# EAGLE design main_board3 (EAGLE 6.1)
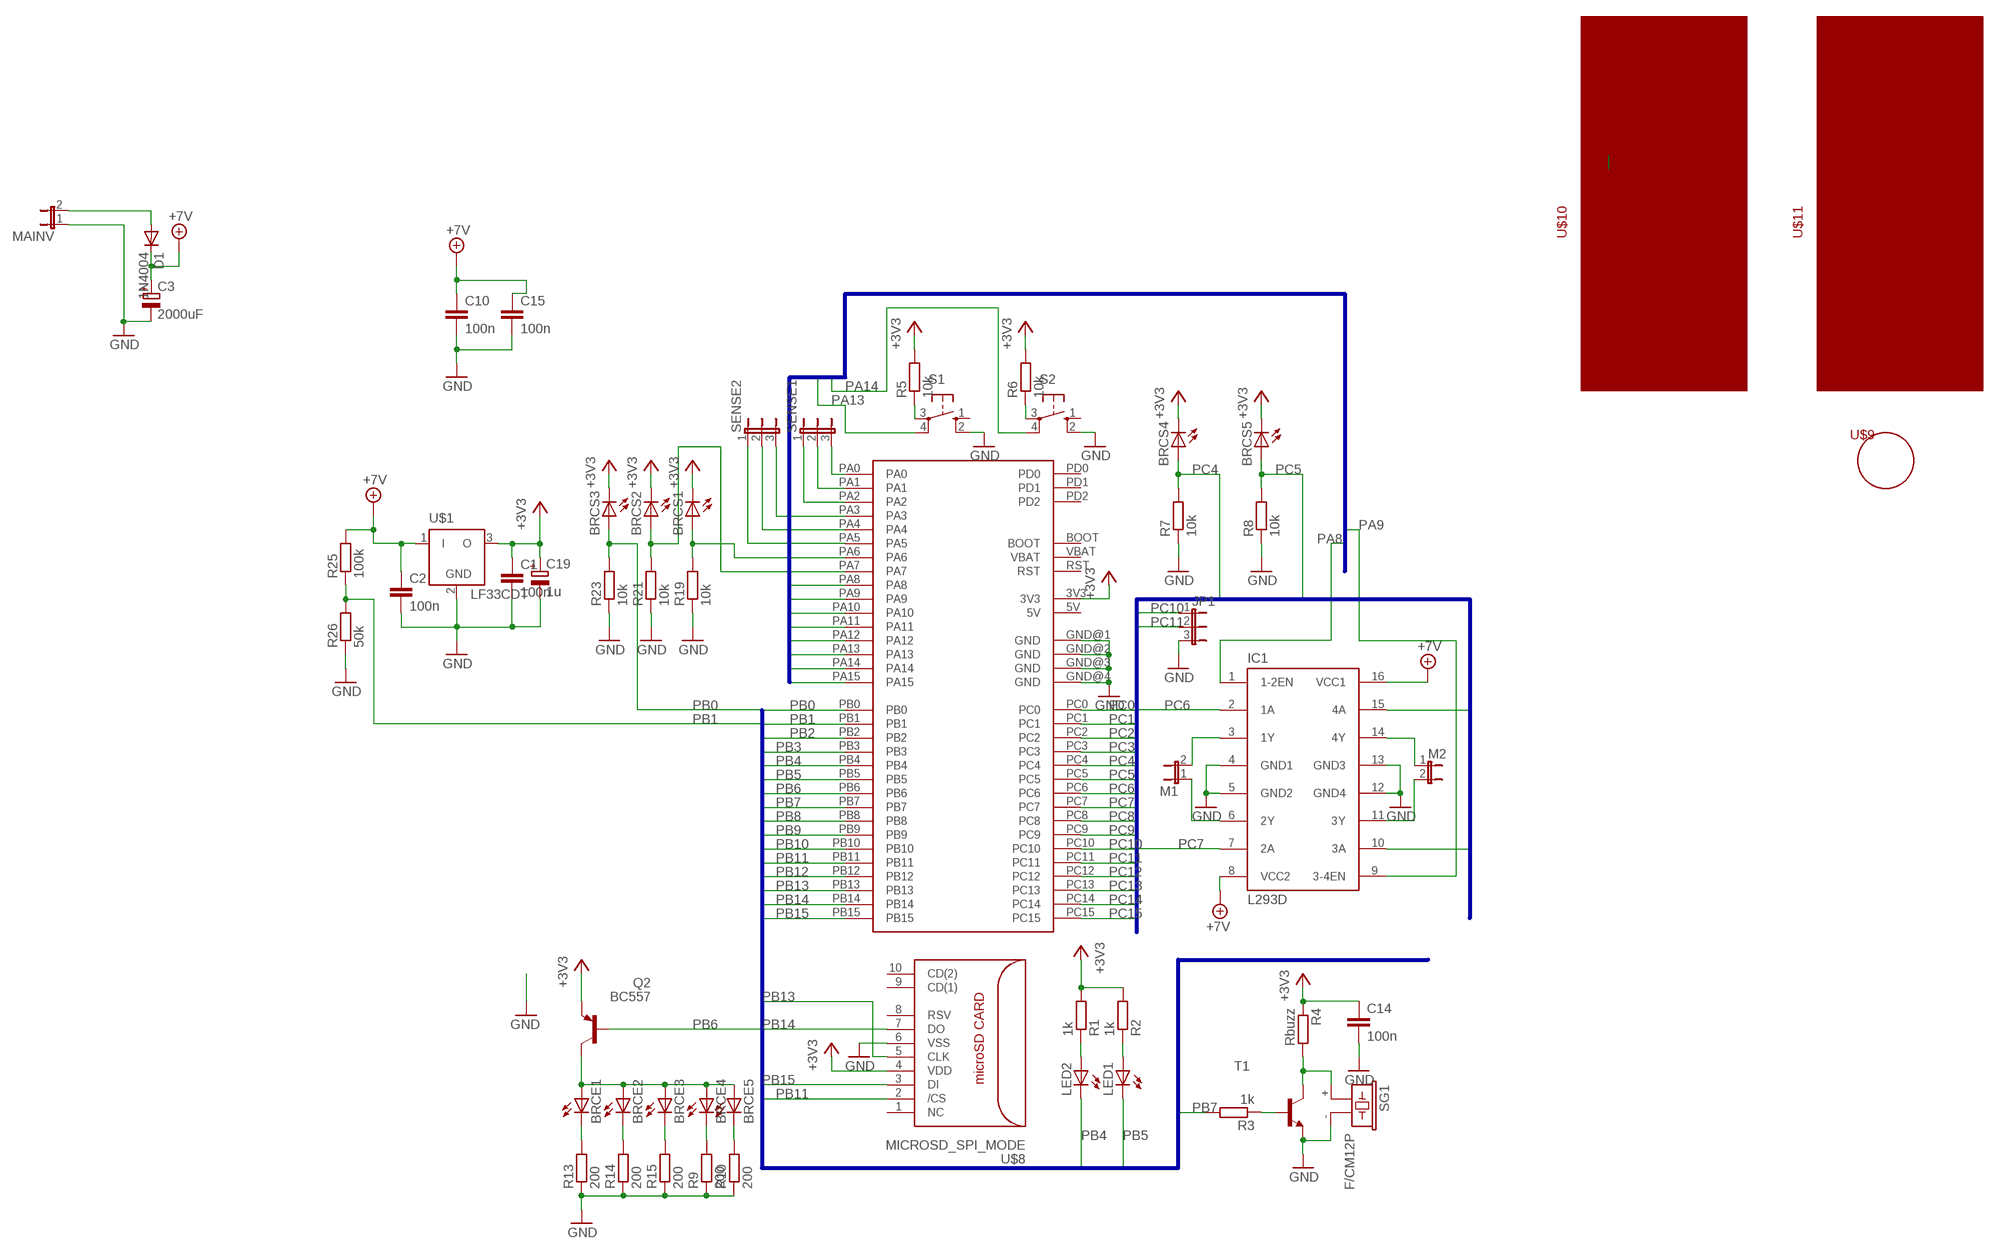
[diagram p0: schematic, sheet 1]

## Parts
BRCE1  LED5MM  [LED5MM]
BRCE2  LED5MM  [LED5MM]
BRCE3  LED5MM  [LED5MM]
BRCE4  LED5MM  [LED5MM]
BRCE5  LED5MM  [LED5MM]
BRCS1  LED5MM  [LED5MM]
BRCS2  LED5MM  [LED5MM]
BRCS3  LED5MM  [LED5MM]
BRCS4  LED5MM  [LED5MM]
BRCS5  LED5MM  [LED5MM]
C1  100n  C-EUC1206  [C1206]
C2  100n  C-EUC1206  [C1206]
C3  2000uF  CPOL-EUE3.5-10  [E3,5-10]
C10  100n  C-EUC1206  [C1206]
C14  100n  C-EUC1206  [C1206]
C15  100n  C-EUC1206  [C1206]
C19  1u  CPOL-EUB  [PANASONIC_B]
D1  1N4004  [DO41-10]
IC1  L293D  [DIL16]
JP1  JP2E  [JP2]
LED1  LED3MM  [LED3MM]
LED2  LED3MM  [LED3MM]
M1  JP1E  [JP1]
M2  JP1E  [JP1]
MAINV  JP1E  [JP1]
Q2  BC557  [TO92]
R1  1k  R-EU_M1206  [M1206]
R2  1k  R-EU_M1206  [M1206]
R3  1k  R-EU_M1206  [M1206]
R4  Rbuzz  R-EU_M1206  [M1206]
R5  10k  R-EU_M1206  [M1206]
R6  10k  R-EU_M1206  [M1206]
R7  10k  R-EU_M1206  [M1206]
R8  10k  R-EU_M1206  [M1206]
R9  200  R-EU_M1206  [M1206]
R10  200  R-EU_M1206  [M1206]
R13  200  R-EU_M1206  [M1206]
R14  200  R-EU_M1206  [M1206]
R15  200  R-EU_M1206  [M1206]
R19  10k  R-EU_M1206  [M1206]
R21  10k  R-EU_M1206  [M1206]
R23  10k  R-EU_M1206  [M1206]
R25  100k  R-EU_M1206  [M1206]
R26  50k  R-EU_M1206  [M1206]
S1  10-XX  [B3F-10XX]
S2  10-XX  [B3F-10XX]
SENSE1  JP2E  [JP2]
SENSE2  JP2E  [JP2]
SG1  F/CM12P  [F/CM12P]
T1  BC547B-NPN-TO92-CBE  [TO92-CBE]
U$1  LF33CDT  [DPAK]
U$2  STM32_DISCOVERY  [STM32_DISCOVERY]
U$8  MICROSD_SPI_MODE  [MICRO_SD_CONNECTOR]
U$9  POLOLU952  [BALLB]
U$10  POLOLU0993B  [MOTORB]
U$11  POLOLU0993B  [MOTORB]

## Nets
+3V3: BRCS1.K(C) BRCS2.K(C) BRCS3.K(C) BRCS4.K(C) BRCS5.K(C) C1.1 C14.1 C19.+ Q2.1(E) R1.2 R2.2 R4.1 R5.2 R6.2 U$1.3(O) U$2.3V3 U$8.4(VDD)
+7V: C2.1 C3.+ C10.1 C15.1 D1.C IC1.8(VCC2) IC1.16(VCC1) R25.2 U$1.1(I)
GND: C1.2 C2.2 C3.- C10.2 C14.2 C15.2 C19.- IC1.4(GND1) IC1.5(GND2) IC1.12(GND4) IC1.13(GND3) JP1.3 MAINV.1 R7.1 R8.1 R9.1 R10.1 R13.1 R14.1 R15.1 R19.1 R21.1 R23.1 R26.1 S1.2(S1) S2.2(S1) SG1.- T1.E U$1.2(GND) U$2.GND@1(GND) U$2.GND@2(GND) U$2.GND@3(GND) U$2.GND@4(GND) U$8.6(VSS)
N$1: SENSE1.3 U$2.PA0
N$2: SENSE1.2 U$2.PA1
N$3: SENSE1.1 U$2.PA2
N$4: SENSE2.3 U$2.PA3
N$5: SENSE2.2 U$2.PA4
N$6: SENSE2.1 U$2.PA5
N$7: LED2.A R1.1
N$8: LED1.A R2.1
N$9: R3.1 T1.B
N$10: R4.2 SG1.+ T1.C
N$11: R6.1 S2.3(P)
N$12: R5.1 S1.3(P)
N$13: BRCE4.K(C) R9.2
N$14: BRCE5.K(C) R10.2
N$28: BRCE1.K(C) R13.2
N$29: BRCE2.K(C) R14.2
N$30: BRCE3.K(C) R15.2
N$31: BRCE1.A BRCE2.A BRCE3.A BRCE4.A BRCE5.A Q2.3(C)
N$43: D1.A MAINV.2
N$44: BRCS1.A R19.2 U$2.PA6
N$46: BRCS2.A R21.2 U$2.PA7
N$53: IC1.3(1Y) M1.2
N$54: IC1.6(2Y) M1.1
N$55: IC1.14(4Y) M2.1
N$56: IC1.11(3Y) M2.2
PA8: IC1.1(1-2EN) U$2.PA8
PA9: IC1.9(3-4EN) U$2.PA9
PA10: U$2.PA10
PA11: U$2.PA11
PA12: U$2.PA12
PA13: S1.4(P1) U$2.PA13
PA14: S2.4(P1) U$2.PA14
PA15: U$2.PA15
PB0: BRCS3.A R23.2 U$2.PB0
PB1: R25.1 R26.2 U$2.PB1
PB2: U$2.PB2
PB3: U$2.PB3
PB4: LED2.K(C) U$2.PB4
PB5: LED1.K(C) U$2.PB5
PB6: Q2.2(B) U$2.PB6
PB7: R3.2 U$2.PB7
PB8: U$2.PB8
PB9: U$2.PB9
PB10: U$2.PB10
PB11: U$2.PB11 U$8.2(/CS)
PB12: U$2.PB12
PB13: U$2.PB13 U$8.5(CLK)
PB14: U$2.PB14 U$8.7(DO)
PB15: U$2.PB15 U$8.3(DI)
PC0: U$2.PC0
PC1: U$2.PC1
PC2: U$2.PC2
PC3: U$2.PC3
PC4: BRCS4.A R7.2 U$2.PC4
PC5: BRCS5.A R8.2 U$2.PC5
PC6: IC1.2(1A) U$2.PC6
PC7: IC1.7(2A) U$2.PC7
PC8: IC1.15(4A) U$2.PC8
PC9: IC1.10(3A) U$2.PC9
PC10: JP1.1 U$2.PC10
PC11: JP1.2 U$2.PC11
PC12: U$2.PC12
PC13: U$2.PC13
PC14: U$2.PC14
PC15: U$2.PC15
Unconnected: S1.1(S) S2.1(S) U$2.5V U$2.BOOT U$2.NC@1(NC) U$2.NC@2(NC) U$2.PD0 U$2.PD1 U$2.PD2 U$2.RST U$2.VBAT U$8.1(NC) U$8.8(RSV) U$8.9(CD(1)) U$8.10(CD(2))

## Buses
PC[0..15]
PB[0..15]
PA[8..15]

## Library data of the parts
BRCE1-BRCE5 BRCS1-BRCS5 LED1 LED2 = led:LED: LED OSRAM: - CHIPLED LG R971, LG N971, LY N971, LG Q971, LY Q971, LO R971, LY R971 LH N974, LH R974 LS Q976, LO Q976, LY Q976 LO Q996 - Hyper CHIPLED LW Q18S LB Q993, LB Q99A, LB R99A - SideLED LS A670, LO A670, LY A670, LG A670, LP A670 LB A673, LV A673, LT A673, LW A673 LH A674 LY A675 LS A676, LA A676, LO A676, LY A676, LW A676 LS A679, LY A679, LG A679 - Hyper Micro SIDELED® LS Y876, LA Y876, LO Y876, LY Y876 LT Y87S - SmartLED LW L88C, LW L88S LB L89C, LB L89S, LG L890 LS L89K, LO L89K, LY L89K LS L896, LA L896, LO L896, LY L896 - TOPLED LS T670, LO T670, LY T670, LG T670, LP T670 LSG T670, LSP T670, LSY T670, LOP T670, LYG T670 LG T671, LOG T671, LSG T671 LB T673, LV T673, LT T673, LW T673 LH T674 LS T676, LA T676, LO T676, LY T676, LB T676, LH T676, LSB T676, LW T676 LB T67C, LV T67C, LT T67C, LS T67K, LO T67K, LY T67K, LW E67C LS E67B, LA E67B, LO E67B, LY E67B, LB E67C, LV E67C, LT E67C LW T67C LS T679, LY T679, LG T679 LS T770, LO T770, LY T770, LG T770, LP T770 LB T773, LV T773, LT T773, LW T773 LH T774 LS E675, LA E675, LY E675, LS T675 LS T776, LA T776, LO T776, LY T776, LB T776 LHGB T686 LT T68C, LB T68C - Hyper Mini TOPLED® LB M676 - Mini TOPLED Santana® LG M470 LS M47K, LO M47K, LY M47K Source: http://www.osram.convergy.de LUXEON: - LUMILED® LXK2-PW12-R00, LXK2-PW12-S00, LXK2-PW14-U00, LXK2-PW14-V00 LXK2-PM12-R00, LXK2-PM12-S00, LXK2-PM14-U00 LXK2-PE12-Q00, LXK2-PE12-R00, LXK2-PE12-S00, LXK2-PE14-T00, LXK2-PE14-U00 LXK2-PB12-K00, LXK2-PB12-L00, LXK2-PB12-M00, LXK2-PB14-N00, LXK2-PB14-P00, LXK2-PB14-Q00 LXK2-PR12-L00, LXK2-PR12-M00, LXK2-PR14-Q00, LXK2-PR14-R00 LXK2-PD12-Q00, LXK2-PD12-R00, LXK2-PD12-S00 LXK2-PH12-R00, LXK2-PH12-S00 LXK2-PL12-P00, LXK2-PL12-Q00, LXK2-PL12-R00 Source: www.luxeon.com KINGBRIGHT: KA-3528ASYC Source: www.kingbright.com
C1 C2 C10 C14 C15 = rcl:C-EU: CAPACITOR, European symbol
C3 C19 = rcl:CPOL-EU: POLARIZED CAPACITOR, European symbol
D1 = diode:1N4004: DIODE general purpose rectifier, 1 A
IC1 = st-microelectronics:L293D: PUSH-PULL 4 CHANNEL DRIVER; MPN: L293D; OC_FARNELL: 9589619; OC_NEWARK: 56P8249
JP1 SENSE1 SENSE2 = jumper:JP2E: JUMPER
M1 M2 MAINV = jumper:JP1E: JUMPER
Q2 = transistor-pnp:BC557: PNP Transistor
R1-R10 R13-R15 R19 R21 R23 R25 R26 = resistor:R-EU_: RESISTOR, European symbol
S1 S2 = switch-omron:10-XX: OMRON SWITCH; MPN: B3F-1000; OC_FARNELL: 176432; OC_NEWARK: 36M3542
SG1 = buzzer:F/CM12P: BUZZER Source: Buerklin; OC_FARNELL: unknown; OC_NEWARK: unknown
T1 = transistor:*-NPN-: NPN Transistror BF959 corrected 2008.03.06
U$1 = robot:LF33CDT
U$2 = stm32_discovery:STM32_DISCOVERY: STM32 Value line discovery
U$8 = con-molex-microsd:MICROSD_SPI_MODE: MOLEX - 49225-0821 - CONNECTEUR MICRO SD PUSH/PUSH REV Fabricant: MOLEX Code commande Farnell: 1366700 <http://fr.farnell.com/molex/49225-0821/connecteur-micro-sd-push-push-rev/dp/1366700?Ntt=1366700> Référence fabricant: 49225-0821
U$9 = robot:POLOLU952
U$10 U$11 = robot:POLOLU0993B

## Board
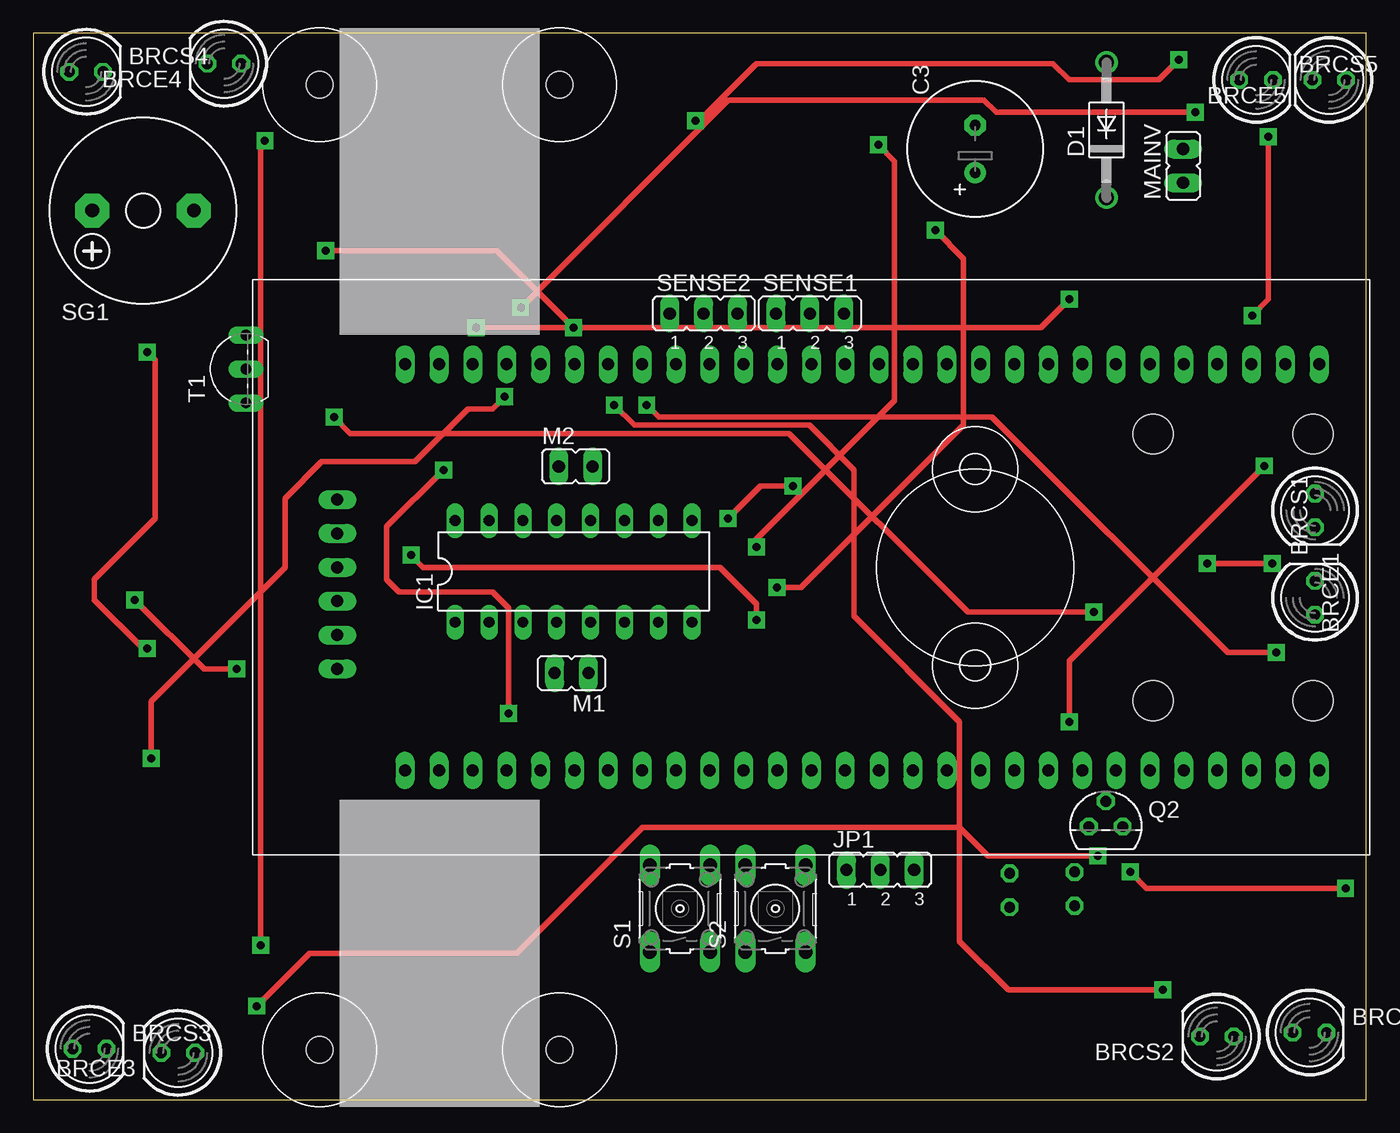
[diagram p1: board, top side]
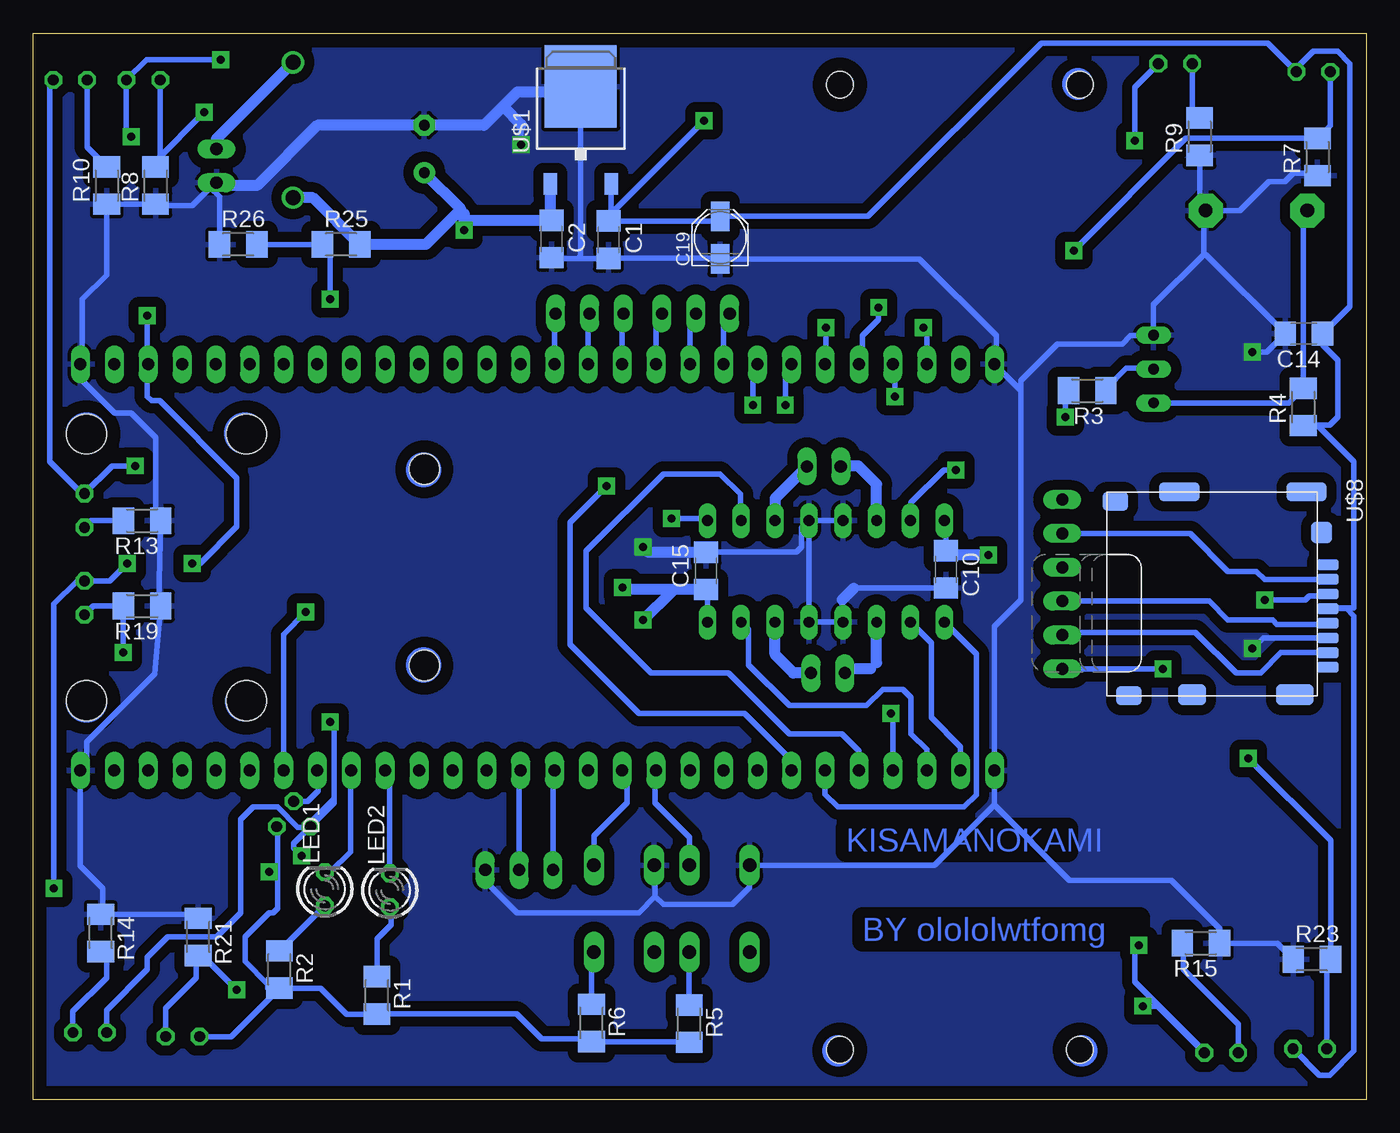
[diagram p2: board, bottom side, seen from below]

Size 100 x 80 mm. Coordinates in mm from the lower left corner, seen from the top.
Outline: 0,0 100,0 100,80 0,80 0,0
Copper layers (1*16): Top 0.035mm / dielectric 1.5mm / Bottom 0.035mm
Design rules "default": minimum track width 10mil, minimum drill 24mil, track to track 8mil, track to pad 8mil, pad to pad 8mil, via to via 8mil, smd to smd 8mil, copper to edge 40mil, drill to drill 8mil, minimum pad ring 10mil, minimum via ring 8mil, stop-mask expansion 4mil, vias tented up to drill 0mil, thermal gap 10mil
Holes 3 mm at 96.01,49.93 96.01,29.93 84.01,49.93 84.01,29.92

### Footprints (pad centres in the part's own frame; a part is rotated, then mirrored left to right if it is on the bottom)
LED5MM = drill 0.813 octagon: A -1.27,0; K 1.27,0
C1206 = smd 1.6 x 1.8: 1 -1.4,0; 2 1.4,0
E3,5-10 = drill 0.813 pad 1.6 round: + -1.778,0 | drill 0.813 pad 1.6 octagon: - 1.778,0
PANASONIC_B = smd 2.2 x 1.4: + 1.6,0; - -1.6,0
DO41-10 = drill 1.118 round: A 5.08,0; C -5.08,0
DIL16 = drill 0.813 long: 1 -8.89,-3.81; 2 -6.35,-3.81; 3 -3.81,-3.81; 4 -1.27,-3.81; 5 1.27,-3.81; 6 3.81,-3.81; 7 6.35,-3.81; 8 8.89,-3.81; 9 8.89,3.81; 10 6.35,3.81; 11 3.81,3.81; 12 1.27,3.81; 13 -1.27,3.81; 14 -3.81,3.81; 15 -6.35,3.81; 16 -8.89,3.81
JP2 = drill 0.914 long: 1 -2.54,0; 2 0,0; 3 2.54,0
LED3MM = drill 0.813 octagon: A -1.27,0; K 1.27,0
JP1 = drill 0.914 long: 1 0,-1.27; 2 0,1.27
TO92 = drill 0.813 octagon: 1 1.27,0; 2 0,1.905; 3 -1.27,0
M1206 = smd 1.6 x 2: 1 -1.4,0; 2 1.4,0
B3F-10XX = drill 1.016 long: 1 -3.251,2.261; 2 3.251,2.261; 3 -3.251,-2.261; 4 3.251,-2.261
F/CM12P = drill 1.016 pad 2.54 octagon: + 3.81,0; - -3.81,0
TO92-CBE = drill 0.813 long: B 0,0; C -2.54,0; E 2.54,0
DPAK = smd 1 x 1.6: 1 -2.28,-6.07; 3 2.28,-6.07 | smd 5.4 x 6.2: 2 0,1.23
STM32_DISCOVERY = drill 0.9 long: 3V3 -15.24,29.21; 5V 15.24,29.21; BOOT 15.24,21.59; GND@1 -15.24,34.29; GND@2 15.24,34.29; GND@3 -15.24,-34.29; GND@4 15.24,-34.29; NC@1 -15.24,31.75; NC@2 15.24,31.75; PA0 -15.24,-1.27; PA1 -15.24,-3.81; PA2 -15.24,-6.35; PA3 -15.24,-8.89; PA4 -15.24,-11.43; PA5 -15.24,-13.97; PA6 -15.24,-16.51; PA7 -15.24,-19.05; PA8 15.24,-21.59; PA9 15.24,-19.05; PA10 15.24,-16.51; PA11 15.24,-13.97; PA12 15.24,-11.43; PA13 15.24,-8.89; PA14 15.24,-6.35; PA15 15.24,-3.81; PB0 -15.24,-26.67; PB1 -15.24,-29.21; PB2 -15.24,-31.75; PB3 15.24,8.89; PB4 15.24,11.43; PB5 15.24,13.97; PB6 15.24,16.51; PB7 15.24,19.05; PB8 15.24,24.13; PB9 15.24,26.67; PB10 -5.08,-39.37; PB11 -2.54,-39.37; PB12 0,-39.37; PB13 2.54,-39.37; PB14 5.08,-39.37; PB15 7.62,-39.37; PC0 -15.24,8.89; PC1 -15.24,6.35; PC2 -15.24,3.81; PC3 -15.24,1.27; PC4 -15.24,-21.59; PC5 -15.24,-24.13; PC6 15.24,-31.75; PC7 15.24,-29.21; PC8 15.24,-26.67; PC9 15.24,-24.13; PC10 15.24,-1.27; PC11 15.24,1.27; PC12 15.24,3.81; PC13 -15.24,24.13; PC14 -15.24,21.59; PC15 -15.24,19.05; PD0 -15.24,16.51; PD1 -15.24,13.97; PD2 15.24,6.35; RST -15.24,11.43; VBAT -15.24,26.67
MICRO_SD_CONNECTOR = smd 0.8 x 1.6: 1 -2.03,8.2; 2 -0.93,8.2; 3 0.17,8.2; 4 1.27,8.2; 5 2.37,8.2; 6 3.47,8.2; 7 4.57,8.2; 8 5.67,8.2 | smd 1.55 x 2.8: 9 7.735,5.7 | smd 1.55 x 2.1: 10 7.735,-2 | smd 1.4 x 1.9: 11 7.81,-6.75; 12 -6.79,-7.75 | smd 1.4 x 3: 13 -7.49,-2.95; 14 -7.49,6.6 | smd 1.6 x 1.55: 15 -4.43,7.725
BALLB = hole 2.286: -7.366,0; 7.366,0
MOTORB = hole 2: -9,7.25; 9,7.25

### Placement (x,y rotation side)
BRCE1  96.16,44.2 270 top
BRCE2  95.76,5.03 0 top
BRCE3  10.87,3.51 180 top
BRCE4  14.33,77.72 180 top
BRCE5  97.23,76.5 180 top
BRCS1  96.16,37.64 90 top
BRCS2  88.8,4.72 180 top
BRCS3  4.22,3.81 0 top
BRCS4  3.96,77.11 0 top
BRCS5  91.74,76.5 0 top
C1  56.85,64.52 270 bottom
C2  61.11,64.57 270 bottom
C3  70.66,71.32 90 top
C10  31.55,39.78 270 bottom
C14  4.67,57.45 180 bottom
C15  49.53,39.67 90 bottom
C19  48.46,64.67 90 bottom
D1  80.52,72.75 90 top
IC1  40.54,39.62 0 top
JP1  63.55,17.22 0 top
LED1  78.13,15.8 90 bottom
LED2  73.25,15.7 90 bottom
M1  40.39,32 90 top
M2  40.69,47.5 270 top
MAINV  86.26,70.05 0 top
Q2  80.47,20.47 0 top
R1  74.22,7.82 270 bottom
R2  81.53,9.75 270 bottom
R3  20.93,53.19 180 bottom
R4  4.72,51.97 90 bottom
R5  50.8,5.69 270 bottom
R6  58.12,5.74 270 bottom
R7  3.66,70.71 90 bottom
R8  90.83,68.58 90 bottom
R9  12.5,72.24 90 bottom
R10  94.49,68.58 90 bottom
R13  91.85,43.43 180 bottom
R14  94.95,12.5 270 bottom
R15  12.4,11.73 180 bottom
R19  91.85,37.03 180 bottom
R21  87.63,12.19 270 bottom
R23  4.06,10.52 0 bottom
R25  76.91,64.16 0 bottom
R26  84.63,64.16 0 bottom
S1  48.51,14.33 90 top
S2  55.68,14.33 90 top
SENSE1  58.27,58.98 0 top
SENSE2  50.29,58.98 0 top
SG1  8.23,66.7 180 top
T1  15.95,54.81 90 top
U$1  58.93,74.78 0 bottom
U$2  62.18,39.93 270 top
U$8  11.07,38.1 270 bottom
U$9  70.66,39.93 90 top
U$10  30.48,68.88 0 top
U$11  30.48,10.97 180 top

### Tracks (layer width: path | path; a pad name or v marks a point on that pad's centre or on a via)
+3V3  (via drill 0.6 pad 1.27)
  Top 0.406: v49.68,73.46 49.99,73.46 54.25,77.72 76.5,77.72 77.72,76.5 84.43,76.5 v85.95,78.03 | v92.66,72.24 92.66,60.05 v91.44,58.83 | v88.09,40.23 v92.96,40.23 | v98.45,15.85 83.52,15.85 v82.3,17.07
  Bottom 0.406: BRCS3.K 3.5,1.83 2.74,1.83 0.91,3.66 0.91,36.27 1.47,36.83 U$8.4 2.82,36.88 0.91,36.88 0.91,47.85 3.63,50.57 R4.1 4.7,50.6 2.74,50.6 2.13,51.21 2.13,55.47 3.27,56.61 C14.1 1.22,59.51 1.22,77.72 2.13,78.64 3.96,78.64 5.23,77.37 BRCS4.K 7.37,79.25 24.38,79.25 37.36,66.27 C19.+ 48.82,65.92 C1.1 | U$1.3 56.65,66.11 C1.1 | C1.1 56.84,66.29 v49.68,73.46 | v85.95,78.03 91.49,78.03 BRCS5.K 93.02,72.59 v92.66,72.24 | v91.44,58.83 91.44,55.22 U$2.3V3 91.44,55.12 91.44,52.73 91.14,52.43 90.53,52.43 84.73,46.63 84.73,42.98 87.48,40.23 v88.09,40.23 | BRCS2.K 85.16,4.72 R2.2 | R2.2 78.46,8.35 76.5,6.4 74.24,6.4 R1.2 63.73,6.42 61.87,4.57 58.35,4.57 R6.2 50.85,4.34 R5.2 | R2.2 82.42,8.35 82.42,8.66 84.12,10.36 84.12,12.19 82.3,14.02 81.99,14.02 81.69,14.33 81.69,17.07 | 81.69,17.07 81.69,20.42 Q2.1 | v92.96,40.23 94.28,38.91 BRCS1.K 96.72,38.91 98.45,37.19 v98.45,15.85 | v82.3,17.07 81.69,17.07
+7V  (via drill 0.6 pad 1.27)
  Top 0.406: v55.78,38.41 57.61,38.41 69.8,50.6 69.8,63.09 v67.67,65.23 | v54.25,35.97 54.25,37.19 51.51,39.93 29.26,39.93 v28.35,40.84
  Bottom 0.406: 49.43,38.17 IC1.8 | 49.43,38.17 C15.1 | 55.65,38.27 v55.78,38.41 | 67.92,66.8 67.67,66.55 67.67,66.45 67.19,65.97 | 52.05,38.17 49.43,38.17 | 31.21,40.84 C10.1 31.55,43.33 IC1.16 | C2.1 61.21,66.06
  Bottom 0.813: C15.1 55.65,38.27 | v67.67,65.23 67.67,66.45 | C3.+ 67.92,66.8 70.56,64.16 R25.2 79.02,67.67 D1.C | 67.19,65.97 C2.1 | v54.25,35.97 52.05,38.17 | v28.35,40.84 31.21,40.84 | 61.21,66.06 U$1.1
GND  (via drill 0.6 pad 1.27)
  Top 0.406: v54.25,41.45 54.25,42.06 64.62,52.43 64.62,70.41 v63.4,71.63 | v8.53,33.83 8.23,33.83 4.57,37.49 4.57,39.01 9.14,43.59 9.14,55.47 v8.53,56.08
  Bottom 0.406: 59.34,75.59 U$1.2 58.93,63.3 59.13,63.09 | 59.13,63.09 56.87,63.09 C1.2 48.51,63.12 C19.- 33.5,63.07 27.74,57.3 27.74,55.32 U$2.GND@3 25.91,53.19 | 59.13,63.09 61.04,63.09 C2.2 | 86.06,68.58 MAINV.1 86.36,68.78 86.72,68.43 | 86.72,68.43 88.09,67.06 90.71,67.06 R8.1 R10.1 94.49,61.87 96.32,60.05 96.32,55.32 U$2.GND@1 96.47,54.1 93.88,51.51 92.66,51.51 90.83,49.68 90.83,43.66 R13.1 90.61,37.34 R19.1 90.91,31.93 96.01,26.82 96.01,25.15 U$2.GND@2 96.47,17.53 94.79,15.85 94.79,14.05 R14.1 87.94,13.9 R21.1 | R26.1 86.03,67.75 86.72,68.43 | 63.4,73.15 v63.4,71.63 | C15.2 42.74,41.08 42.37,41.45 42.37,42.88 IC1.12 | IC1.12 IC1.5 IC1.4 39.32,35.87 39.32,37.49 | IC1.12 IC1.13 | 38.43,38.38 C10.2 | 25.91,53.19 25.91,37.49 27.89,35.51 U$2.GND@4 27.89,22.1 | 25.91,53.19 25.91,53.95 23.16,56.69 18.29,56.69 17.68,57.3 16,57.3 T1.E 15.95,59.64 12.19,63.4 | 12.19,63.4 12.19,66.75 12.09,66.75 SG1.- | R9.1 12.5,67.16 SG1.- | SG1.- 9.5,66.7 7.32,68.89 6.1,68.89 5.49,69.49 3.84,69.49 R7.1 | 12.19,63.4 12.02,63.4 C14.2 7.45,56.08 v8.53,56.08 | 3.06,34.44 U$8.6 7.74,34.63 v8.53,33.83 | 27.89,22.1 22.25,16.46 14.63,16.46 10.97,12.8 10.97,11.76 R15.1 6.68,11.73 R23.1 | JP1.3 66.09,16.41 63.7,14.02 54.56,14.02 53.34,15.24 | 53.34,15.24 53.34,17.5 S2.2 | 53.34,15.24 52.73,14.63 47.55,14.63 46.25,15.93 S1.2 32.41,17.58 27.89,22.1
  Bottom 0.813: 64.77,74.52 63.7,75.59 59.34,75.59 | 64.77,74.52 66.19,73.1 C3.- 78.69,73.1 83.21,68.58 86.06,68.58 | C15.2 53.88,41.08 v54.25,41.45 | 64.77,74.52 63.4,73.15 | 39.32,37.49 38.43,38.38
  pour Bottom (isolate 0.762): 0.91,79.25 99.36,79.25 99.36,0.61 0.61,0.61 0.61,0.91 0.91,0.91 0.91,78.94
N$1
  Bottom 0.406: U$2.PA0 60.91,58.88 SENSE1.3
N$2
  Bottom 0.406: U$2.PA1 58.37,58.88 SENSE1.2
N$3
  Bottom 0.406: U$2.PA2 55.83,58.88 SENSE1.1
N$4
  Bottom 0.406: U$2.PA3 53.29,58.52 SENSE2.3
N$5
  Bottom 0.406: U$2.PA4 50.75,58.52 SENSE2.2
N$6
  Bottom 0.406: U$2.PA5 48.21,58.52 SENSE2.1
N$7
  Bottom 0.406: R1.1 74.22,12.04 73.15,13.11 73.15,14.33 LED2.A
N$8
  Bottom 0.406: R2.1 81.51,11.15 LED1.A
N$9
  Bottom 0.406: R3.1 19.53,53.32 17.98,54.86 16,54.86 T1.B
N$10
  Bottom 0.406: T1.C 5.82,52.27 R4.2 4.72,66.4 SG1.+
N$11
  Bottom 0.406: R6.1 58.12,10.9 S2.3
N$12
  Bottom 0.406: R5.1 50.8,10.26 51.21,10.67 51.18,10.67 S1.3
N$13
  Bottom 0.406: BRCE4.K 13.06,74.2 R9.2
N$14
  Bottom 0.406: BRCE5.K 95.96,71.45 R10.2
N$28
  Bottom 0.406: R13.2 95.66,43.43 BRCE1.K
N$29
  Bottom 0.406: BRCE2.K 97.03,6.6 94.49,9.14 94.49,10.64 R14.2
N$30
  Bottom 0.406: BRCE3.K 9.6,5.64 13.72,9.75 13.72,11.66 R15.2
N$31  (via drill 0.6 pad 1.27)
  Top 0.406: v77.72,28.35 77.72,32.92 v92.35,47.55 | v79.86,18.29 71.63,18.29 69.49,20.42 45.72,20.42 36.27,10.97 20.73,10.97 v16.76,7.01 | v17.07,11.58 17.07,71.63 v17.37,71.93
  Bottom 0.406: BRCE5.A 98.75,76.25 98.75,47.85 96.37,45.47 BRCE1.A 94.08,47.55 v92.35,47.55 | BRCE2.A 94.49,6.71 91.44,9.75 91.44,10.67 89.92,12.19 86.26,12.19 84.43,14.02 84.43,21.03 83.52,21.95 81.69,21.95 80.16,20.42 79.25,20.42 Q2.3 79.2,20.78 77.42,22.55 | 77.42,22.55 77.42,28.04 v77.72,28.35 | 77.42,22.55 77.42,22.25 80.47,19.2 80.47,18.9 v79.86,18.29 | v16.76,7.01 15.65,7.01 BRCE3.A 12.14,3.61 17.37,8.84 17.37,11.28 v17.07,11.58 | v17.37,71.93 17.37,75.95 BRCE4.A
N$43
  Bottom 0.813: MAINV.2 86.26,72.08 D1.A
N$44  (via drill 0.6 pad 1.27)
  Top 0.406: v93.27,33.53 89.61,33.53 71.93,51.21 46.94,51.21 v46.02,52.12
  Bottom 0.406: BRCS1.A 95.5,37.03 R19.2 93.25,33.55 v93.27,33.53 | v46.02,52.12 46.02,54.81 U$2.PA6
N$46  (via drill 0.6 pad 1.27)
  Top 0.406: v84.73,8.23 73.15,8.23 69.49,11.89 69.49,28.35 61.57,36.27 61.57,47.24 58.22,50.6 45.11,50.6 v43.59,52.12
  Bottom 0.406: BRCS2.A 90.07,6.86 87.78,9.14 87.78,10.64 R21.2 87.3,10.79 v84.73,8.23 | v43.59,52.12 43.59,54.71 U$2.PA7
N$53
  Bottom 0.406: 37.19,32.31 36.73,32.77 | 38.81,32.31 M1.2
  Bottom 0.813: 36.73,32.77 IC1.3 | 37.19,32.31 38.81,32.31
N$54
  Bottom 0.813: IC1.6 44.35,33.38 42.98,32 M1.1
N$55
  Bottom 0.406: 39.37,47.55 M2.1
  Bottom 0.813: IC1.14 36.73,46.18 38.1,47.55 39.37,47.55
N$56
  Bottom 0.813: IC1.11 44.35,45.11 M2.2
PA8
  Bottom 0.406: U$2.PA8 40.59,22.91 39.62,21.95 30.18,21.95 29.26,22.86 29.26,33.43 IC1.1
PA9  (via drill 0.6 pad 1.27)
  Top 0.406: v57,46.02 54.56,46.02 v52.12,43.59
  Bottom 0.406: U$2.PA9 43.13,25.45 46.63,28.96 54.56,28.96 59.74,34.14 59.74,43.28 v57,46.02 | v52.12,43.59 49.58,43.59 IC1.9
PA13
  Bottom 0.406: S1.4 50.77,19.68 53.34,22.25 53.34,24.64 U$2.PA13
PA14
  Bottom 0.406: S2.4 57.94,19.79 55.47,22.25 55.47,24.33 U$2.PA14
PB0  (via drill 0.6 pad 1.27)
  Top 0.406: v8.84,25.6 8.84,29.87 18.9,39.93 18.9,45.11 21.64,47.85 28.65,47.85 32.61,51.82 34.44,51.82 v35.36,52.73
  Bottom 0.406: BRCS3.A 2.95,10.23 R23.2 2.66,19.43 v8.84,25.6 | v35.36,52.73 35.36,55.02 U$2.PB0
PB1  (via drill 0.6 pad 1.27)
  Top 0.406: v33.22,57.91 75.59,57.91 v77.72,60.05
  Bottom 0.406: R26.2 R25.1 77.72,63.57 v77.72,60.05 | U$2.PB1 32.97,57.66 v33.22,57.91
PB4
  Bottom 0.406: LED2.K 73.25,24.33 U$2.PB4
PB5
  Bottom 0.406: LED1.K 77.72,17.07 76.2,18.59 76.2,24.64 U$2.PB5
PB6
  Bottom 0.406: Q2.2 79.43,22.38 78.64,23.16 78.64,24.64 U$2.PB6
PB7  (via drill 0.6 pad 1.27)
  Top 0.406: v79.55,36.58 70.1,36.58 56.69,49.99 23.77,49.99 v22.55,51.21
  Bottom 0.406: U$2.PB7 81.23,34.9 v79.55,36.58 | v22.55,51.21 22.55,52.96 R3.2
PB11
  Bottom 0.406: U$2.PB11 13.21,42.47 10.36,39.62 8.23,39.62 7.62,39.01 2.89,39.01 U$8.2
PB13
  Bottom 0.406: U$2.PB13 11.79,37.39 10.36,35.97 7.01,35.97 6.71,35.66 2.94,35.66 U$8.5
PB14
  Bottom 0.406: U$8.7 6.4,33.53 7.92,32 9.75,32 12.8,35.05 22.61,35.05 U$2.PB14
PB15  (via drill 0.6 pad 1.27)
  Top 0.406: v15.24,32.31 12.8,32.31 v7.62,37.49
  Bottom 0.406: v15.24,32.31 U$2.PB15 | v7.62,37.49 4.57,37.49 4.27,37.8 3.01,37.8 U$8.3
PC4  (via drill 0.6 pad 1.27)
  Top 0.406: v21.95,63.7 34.75,63.7 v40.54,57.91
  Bottom 0.406: BRCS4.A 2.69,73.08 R7.2 13.54,72.11 v21.95,63.7 | v40.54,57.91 40.54,55.22 U$2.PC4
PC5  (via drill 0.6 pad 1.27)
  Top 0.406: v87.17,74.07 72.24,74.07 71.32,74.98 52.12,74.98 v36.58,59.44
  Bottom 0.406: BRCS5.A 90.47,70.34 R8.2 90.83,70.41 v87.17,74.07 | v36.58,59.44 36.58,58.52 37.8,57.3 37.8,55.42 U$2.PC5
PC6
  Bottom 0.406: U$2.PC6 30.43,26.47 32.61,28.65 32.61,34.24 IC1.2
PC7
  Bottom 0.406: U$2.PC7 32.97,26.26 34.14,27.43 34.14,30.18 34.75,30.79 36.27,30.79 37.49,29.57 43.28,29.57 46.33,32.61 46.33,35.26 IC1.7
PC8  (via drill 0.6 pad 1.27)
  Top 0.406: v35.66,28.96 35.66,36.88 34.44,38.1 27.43,38.1 26.52,39.01 26.52,42.98 v30.79,47.24
  Bottom 0.406: U$2.PC8 35.51,28.8 v35.66,28.96 | v30.79,47.24 31.7,47.24 34.14,44.81 34.14,43.48 IC1.15
PC9
  Bottom 0.406: U$2.PC9 38.05,26.16 39.32,27.43 43.28,27.43 47.85,32 53.65,32 58.52,36.88 58.52,41.15 52.73,46.94 48.46,46.94 46.94,45.41 46.94,43.48 IC1.10
PC10
  Bottom 0.406: JP1.1 61.01,24.59 U$2.PC10
PC11
  Bottom 0.406: JP1.2 63.55,24.59 U$2.PC11
(copper drawn outside any net)
  shapes: Bottom circle x10

### Text on the board
Bottom: KISAMANOKAMI | BY olololwtfomg